# EAGLE design Firefly (EAGLE 9.6.2)
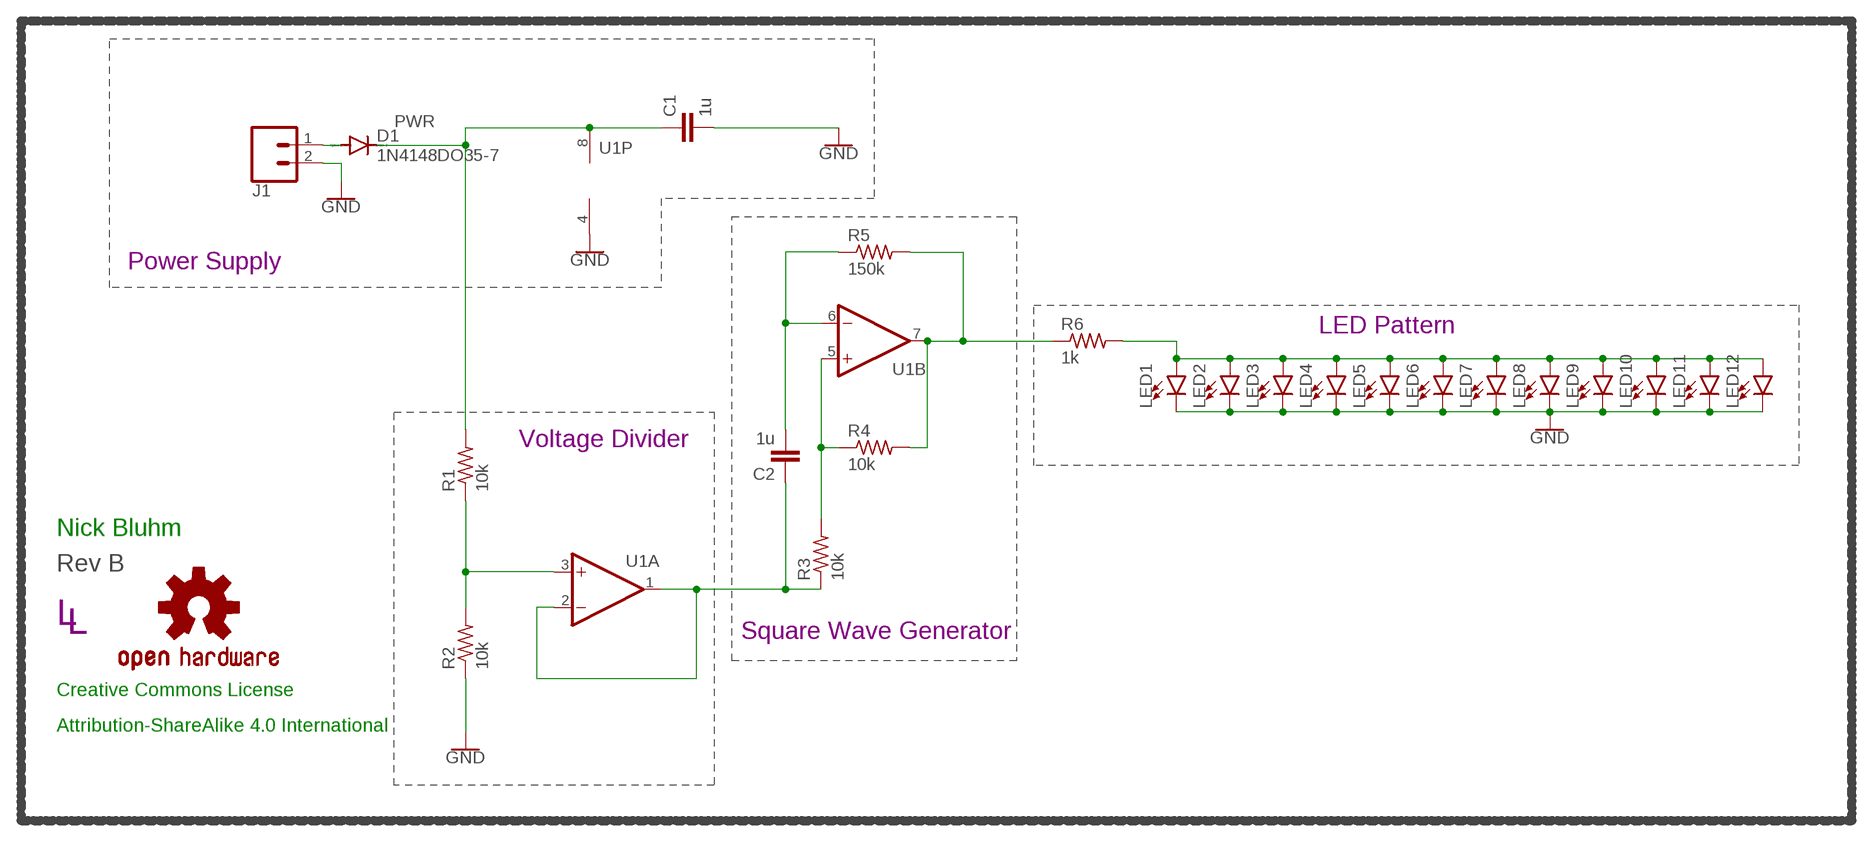
[diagram p0: schematic, sheet 1]

## Parts
C1  1u  CAPACITOR0805  [C0805]
C2  1u  CAPACITOR0805  [C0805]
D1  1N4148DO35-7  [DO35-7]
J1  CONN_02  [1X02]
LED1  LED5MM  [LED_5MM]
LED2  LED5MM  [LED_5MM]
LED3  LED5MM  [LED_5MM]
LED4  LED5MM  [LED_5MM]
LED5  LED5MM  [LED_5MM]
LED6  LED5MM  [LED_5MM]
LED7  LED5MM  [LED_5MM]
LED8  LED5MM  [LED_5MM]
LED9  LED5MM  [LED_5MM]
LED10  LED5MM  [LED_5MM]
LED11  LED5MM  [LED_5MM]
LED12  LED5MM  [LED_5MM]
LOGO1  OSHW-LOGOL  [OSHW-LOGO-L]
R1  10k  RESISTOR0805  [R0805]
R2  10k  RESISTOR0805  [R0805]
R3  10k  RESISTOR0805  [R0805]
R4  10k  RESISTOR0805  [R0805]
R5  150k  RESISTOR0805  [R0805]
R6  1k  RESISTOR0805  [R0805]
U1  OP-DUALMCP6002R  [SO8]
U$4  REVISION.B  [REV.B]
U$5  LINNES.LAB.LOGO  [LINNES.LAB.LOGO]

## Nets
GND: C1.2 J1.2 LED1.K(C) LED2.K(C) LED3.K(C) LED4.K(C) LED5.K(C) LED6.K(C) LED7.K(C) LED8.K(C) LED9.K(C) LED10.K(C) LED11.K(C) LED12.K(C) R2.1 U1.4(P:V-)
N$1: D1.A J1.1
N$2: R1.1 R2.2 U1.3(A:+IN)
N$3: LED1.A LED2.A LED3.A LED4.A LED5.A LED6.A LED7.A LED8.A LED9.A LED10.A LED11.A LED12.A R6.2
N$4: C2.1 R3.1 U1.1(A:OUT) U1.2(A:-IN)
N$5: C2.2 R5.1 U1.6(B:-IN)
N$6: R3.2 R4.1 U1.5(B:+IN)
N$7: R4.2 R5.2 R6.1 U1.7(B:OUT)
PWR: C1.1 D1.C R1.2 U1.8(P:V+)

## Notes on the sheet
- Power Supply
- LED Pattern
- Voltage Divider
- Nick Bluhm
- Square Wave Generator
- Creative Commons License
- Attribution-ShareAlike 4.0 International

## Library data of the parts
C1 C2 = LinnesLab-Passives:CAPACITOR
D1 = diode:1N4148: DIODE high speed (Philips)
J1 = LinnesLab-Connectors:CONN_02: Multi connection point. Often used as Generic Header-pin footprint for 0.1 inch spaced/style header connections On any of the 0.1 inch spaced packages, you can populate with these: Break Away Headers - Straight <https://www.sparkfun.com/products/116> (PRT-00116) Break Away Male Headers - Right Angle <https://www.sparkfun.com/products/553> (PRT-00553) Female Headers <https://www.sparkfun.com/products/115> (PRT-00115) Break Away Headers - Machine Pin <https://www.sparkfun.com/products/117> (PRT-00117) Break Away Female Headers - Swiss Machine Pin <https://www.sparkfun.com/products/743> (PRT-00743) For SCREWTERMINALS and SPRING TERMINALS visit here: Screw Terimnals on SparkFun.com <https://www.sparkfun.com/search/results?term=Screw+Terminals> (5mm/3.5mm/2.54mm spacing) This device is also useful as a general connection point to wire up your design to another part of your project. Our various solder wires solder well into these plated through hole pads. Hook-Up Wire - Assortment (Stranded, 22 AWG) <https://www.sparkfun.com/products/11375> (PRT-11375) Hook-Up Wire - Assortment (Solid Core, 22 AWG) <https://www.sparkfun.com/products/11367> (PRT-11367) View the entire wire category on our website here <https://www.sparkfun.com/categories/141> Special notes: Molex polarized connector foot print use with: PRT-08233 with associated crimp pins and housings. 2.54_SCREWTERM for use with PRT-10571. 3.5mm Screw Terminal footprints for PRT-08084 5mm Screw Terminal footprints for use with PRT-08432
LED1-LED12 = CalvEngIO-LED:LED: LED (Generic) Standard schematic elements and footprints for 5mm, 3mm, 1206, and 0603 sized LEDs. Generic LEDs with no color specified. LTST-C190KGKT: arrow indicates cathode
LOGO1 = CalvEngIO-Logos:OSHW-LOGO: Open-Source Hardware (OSHW) Logo This logo indicates the piece of hardware it is found on incorporates a OSHW license and/or adheres to the definition of open source hardware found here: http://freedomdefined.org/OSHW
R1-R6 = LinnesLab-Passives:RESISTOR
U1 = LinnesLab-AnalogIC:OP-DUAL: Precision Micropower, Low Noise CMOS, Rail-to-Rail Input/Output Operational Amplifiers Source: http://www.analog.com/static/imported-files/data_sheets/AD8603_8607_8609.pdf; DIGIKEY: MCP6002T-I/SNCT-ND; MF: Microchip Technology; MPN: MCP6002T-I/SN
U$4 = LinnesLab-Symbols:REVISION.B
U$5 = CalvEngIO-Logos:LINNES.LAB.LOGO

## Board
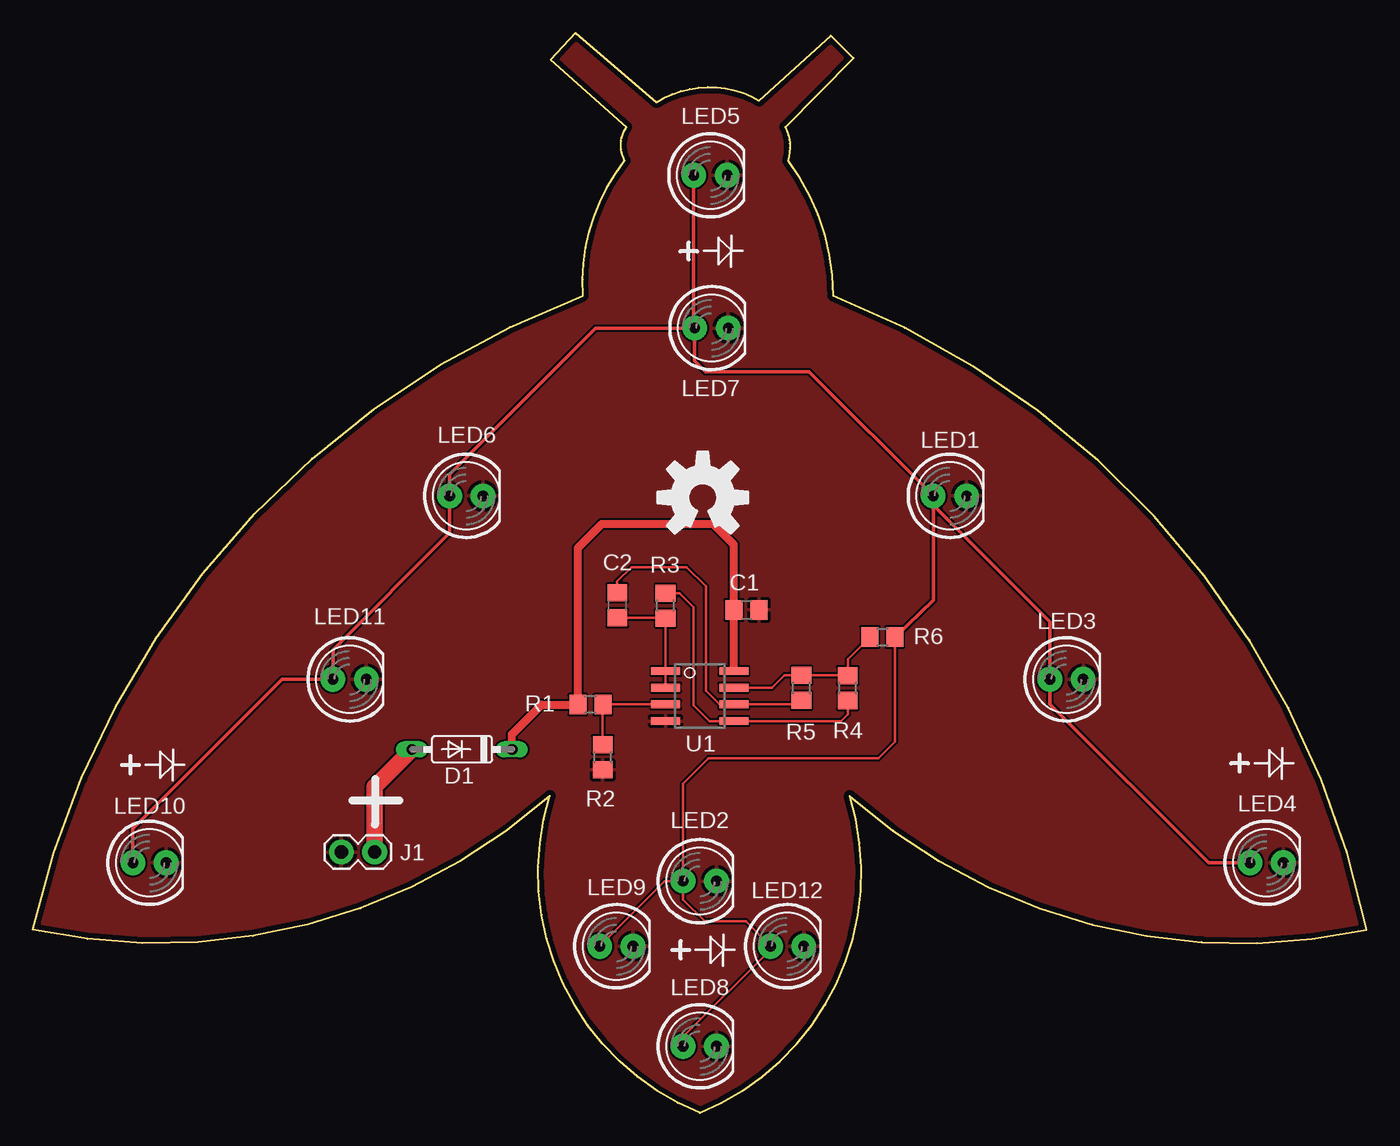
[diagram p1: board, top side]
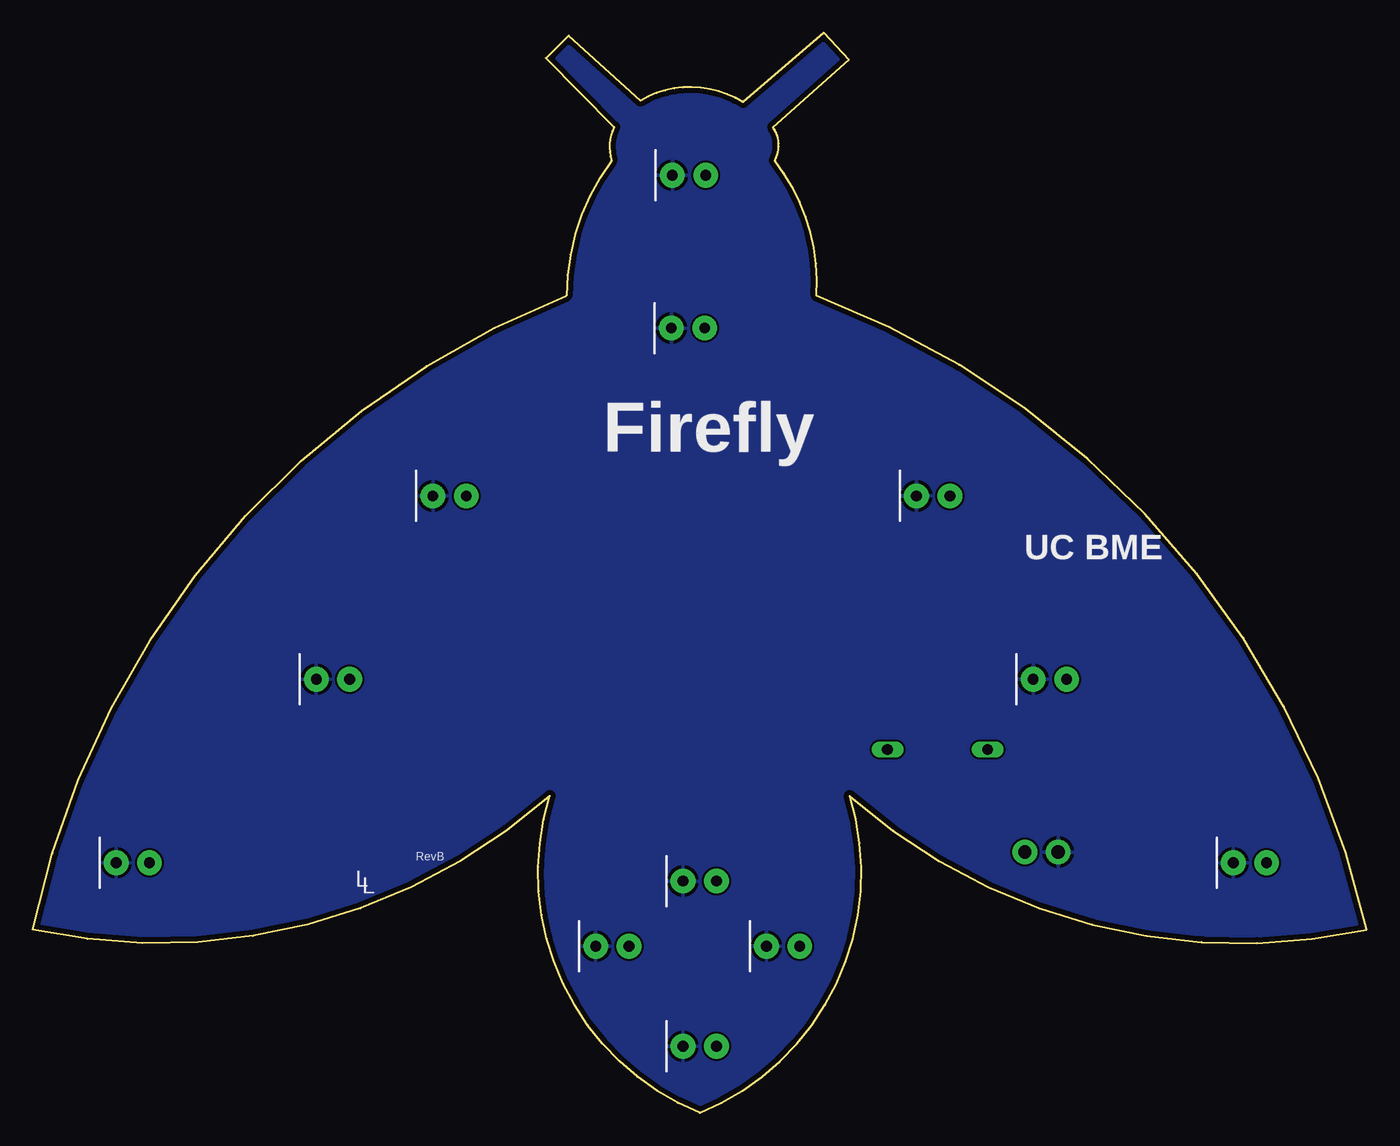
[diagram p2: board, bottom side, seen from below]

Size 101.6 x 82.25 mm. Coordinates in mm from the lower left corner, seen from the top.
Outline: 57.33,75.06 62.51,80.31 60.78,82.04 55.32,77.09 arc62 47.5,76.96 41.35,82.24 39.45,80.21 45.21,75.06 arc63 45.08,72.52 arc42 41.91,62.23 arc57 0,13.97 arc54 39.37,24.13 arc85 50.8,0 arc85 62.23,24.13 arc54 101.6,13.97 arc57 60.96,62.23 arc36 57.53,72.52 arc41 57.33,75.06
Copper layers (1*16): Top 0.0356mm / dielectric 1.5011mm / Bottom 0.0356mm
Design rules "LaenPCBOrder": minimum track width 6mil, minimum drill 13mil, track to track 6mil, track to pad 6mil, pad to pad 6mil, via to via 6mil, smd to smd 6mil, copper to edge 15mil, drill to drill 6mil, minimum pad ring 7mil, minimum via ring 7mil, stop-mask expansion 3mil, vias tented up to drill 0mil, thermal gap 10mil

### Footprints (pad centres in the part's own frame; a part is rotated, then mirrored left to right if it is on the bottom)
C0805 = smd 1.3 x 1.5: 1 -0.95,0; 2 0.95,0
DO35-7 = drill 0.813 long: A 3.81,0; C -3.81,0
1X02 = drill 1.016 pad 1.88: 1 0,0; 2 2.54,0
LED_5MM = drill 0.813 pad 1.88: A -1.27,0; K 1.27,0
R0805 = smd 1.3 x 1.5: 1 -0.95,0; 2 0.95,0
SO8 = smd 0.6 x 2.2: 1 -1.905,-2.6; 2 -0.635,-2.6; 3 0.635,-2.6; 4 1.905,-2.6; 5 1.905,2.6; 6 0.635,2.6; 7 -0.635,2.6; 8 -1.905,2.6

### Placement (x,y rotation side)
C1  54.36,38.3 0 top
C2  44.51,38.65 90 top
D1  32.69,27.69 180 top
J1  26.03,19.86 180 top
LED1  69.85,46.99 0 top
LED2  50.8,17.65 0 top
LED3  78.74,33.02 0 top
LED4  93.98,19.05 0 top
LED5  51.61,71.4 0 top
LED6  33.02,46.99 0 top
LED7  51.69,59.77 0 top
LED8  50.8,5.08 0 top
LED9  44.45,12.7 0 top
LED10  8.89,19.05 0 top
LED11  24.13,33.02 0 top
LED12  57.45,12.7 0 top
LOGO1  51.03,46.86 0 top
R1  42.47,31.09 180 top
R2  43.41,27.09 90 top
R3  48.19,38.63 90 top
R4  62.07,32.35 90 top
R5  58.54,32.36 90 top
R6  64.71,36.24 0 top
U1  50.8,31.75 270 top
U$4  72.44,19.23 0 bottom
U$5  77.04,17.22 0 bottom

### Tracks (layer width: path | path; a pad name or v marks a point on that pad's centre or on a via)
GND
  pour Top: 104.32,88.95 104.32,-0.71 -1.09,-0.71 -1.09,88.95
  pour Bottom: 0,88.19 0,-0.48 103.05,-0.48 103.05,88.19
N$1
  Top 1.27: J1.1 26.03,24.84 D1.A
N$2
  Top 0.203: R2.2 43.41,31.09 R1.1 43.44,31.11 U1.3
N$3
  Top 0.203: LED7.A 50.34,59.84 | LED1.A 68.58,46.28 | LED8.A 49.53,5.79 56.18,12.45 LED12.A 54.3,14.58 51.19,14.58 49.53,16.24 LED2.A | LED2.A 48.13,17.65 LED9.A | LED2.A 49.53,25.08 51.47,27.02 64.4,27.02 65.66,28.28 R6.2
  Top 0.254: LED10.A 7.62,21.64 19,33.02 LED11.A 22.86,35.28 31.75,44.17 LED6.A 31.75,48.64 42.87,59.77 LED7.A 50.42,57.26 51.25,56.44 59.13,56.44 LED1.A 68.58,39.03 R6.2 | LED5.A 50.34,59.84 | 68.58,46.28 77.47,37.39 LED3.A 77.47,31.14 89.56,19.05 LED4.A
N$4
  Top 0.203: U1.2 U1.1 R3.1 48.17,37.7 C2.1
N$5
  Top 0.203: R5.1 58.51,31.25 58.37,31.11 U1.6 52.3,31.11 51.26,32.16 51.26,40.11 49.81,41.55 45.59,41.55 44.51,40.47 C2.2
N$6
  Top 0.203: R4.1 62.07,30.37 61.54,29.84 U1.5 51.54,29.84 50.34,31.04 50.34,38.51 49.27,39.58 R3.2
N$7
  Top 0.203: U1.7 56.31,32.38 57.24,33.31 R5.2 R4.2 62.07,34.55 R6.1
PWR
  Top 0.381: C1.1
  Top 0.61: D1.C 36.5,28.85 38.74,31.09 R1.2 41.52,43.03 43.35,44.86 51.82,44.86 53.41,43.27 C1.1 | U1.8 C1.1

### Text on the board
bPlace: Firefly | UC BME